# EAGLE schematic usb tester (EAGLE 7.6.0)
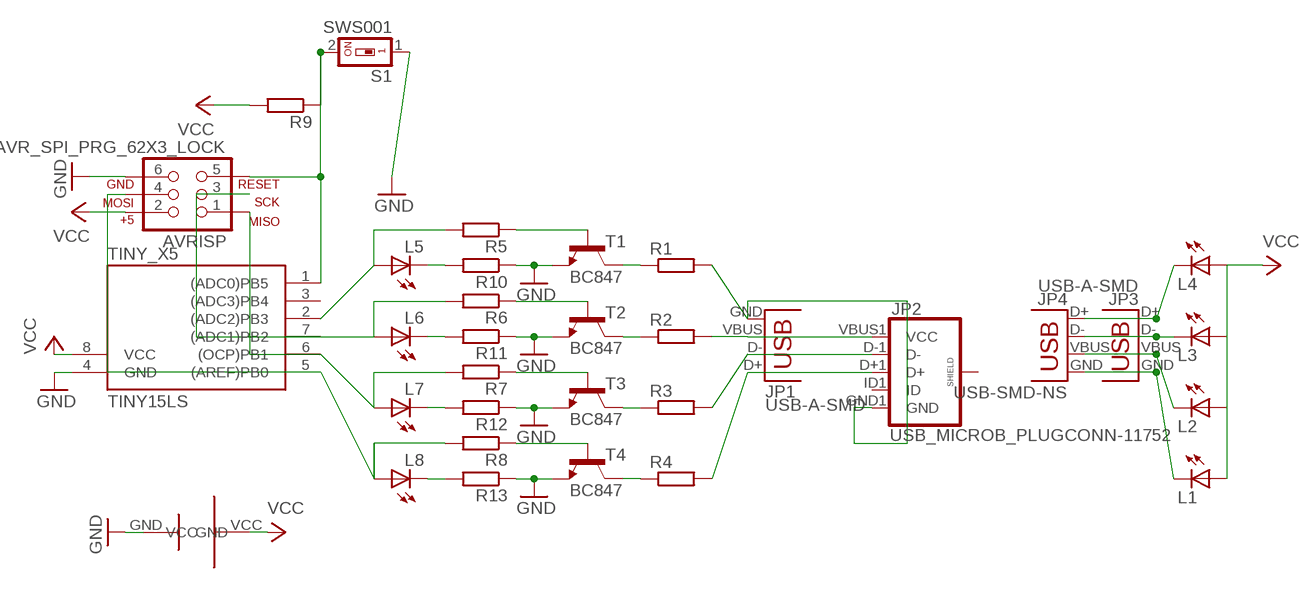
[diagram p0: schematic, sheet 1]

## Parts
AVRISP  AVR_SPI_PRG_62X3_LOCK  [2X3_LOCK]
JP1  USB-A-SMD  [USB-A-S-NOSILK-FEMALE]
JP2  USB_MICROB_PLUGCONN-11752  [USB-B-MICRO-SMD_V03]
JP3  USB-A-SMD  [USB-A-S-NOSILK-FEMALE]
JP4  USB-SMD-NS  [USB-MINIB-NOSTOP]
L1  LEDSMT1206  [1206]
L2  LEDSMT1206  [1206]
L3  LEDSMT1206  [1206]
L4  LEDSMT1206  [1206]
L5  LEDSMT1206  [1206]
L6  LEDSMT1206  [1206]
L7  LEDSMT1206  [1206]
L8  LEDSMT1206  [1206]
R1  R-EU_R1206  [R1206]
R2  R-EU_R1206  [R1206]
R3  R-EU_R1206  [R1206]
R4  R-EU_R1206  [R1206]
R5  R-EU_R1206  [R1206]
R6  R-EU_R1206  [R1206]
R7  R-EU_R1206  [R1206]
R8  R-EU_R1206  [R1206]
R9  R-EU_R1206  [R1206]
R10  R-EU_R1206  [R1206]
R11  R-EU_R1206  [R1206]
R12  R-EU_R1206  [R1206]
R13  R-EU_R1206  [R1206]
S1  SWS001  [SMS-001]
T1  BC847  [SOT23]
T2  BC847  [SOT23]
T3  BC847  [SOT23]
T4  BC847  [SOT23]
TINY_X5  TINY15LS  [SOIC8]
U$1  BATTERY  [BATTERY]

## Nets
GND: AVRISP.6 R10.1 R11.1 R12.1 R13.1 S1.1 T1.2(E) T2.2(E) T3.2(E) T4.2(E) TINY_X5.4(GND) U$1.GND
N$1: R1.1 T1.3(C)
N$2: R2.1 T2.3(C)
N$3: R3.1 T3.3(C)
N$4: R4.1 T4.3(C)
N$5: R5.1 T1.1(B)
N$7: R7.1 T3.1(B)
N$8: AVRISP.1 L7.A R7.2 TINY_X5.6((OCP)PB1)
N$9: R8.1 T4.1(B)
N$10: JP1.GND JP2.GND1(GND) R1.2
N$11: JP1.VBUS JP2.VBUS1(VCC) R2.2
N$12: JP1.D- JP2.D-1(D-) R3.2
N$13: JP1.D+ JP2.D+1(D+) R4.2
N$14: AVRISP.4 L8.A R8.2 TINY_X5.5((AREF)PB0)
N$16: L5.A R5.2 TINY_X5.2((ADC2)PB3)
N$19: JP3.GND JP4.GND L1.C
N$20: JP3.VBUS JP4.VBUS L2.C
N$21: JP3.D- JP4.D- L3.C
N$22: JP3.D+ JP4.D+ L4.C
N$25: L8.C R13.2
N$26: AVRISP.5 R9.1 S1.2 TINY_X5.1((ADC0)PB5)
N$27: AVRISP.3 L6.A R6.2 TINY_X5.7((ADC1)PB2)
N$30: L5.C R10.2
N$31: L6.C R11.2
N$32: L7.C R12.2
N$33: R6.1 T2.1(B)
VCC: AVRISP.2 L1.A L2.A L3.A L4.A R9.2 TINY_X5.8(VCC) U$1.VCC
Unconnected: JP2.ID1(ID) JP2.SHIELD1(SHIELD) JP2.SHIELD2(SHIELD) JP2.SHIELD3(SHIELD) TINY_X5.3((ADC3)PB4)

## Library data of the parts
AVRISP = SparkFun-Connectors:AVR_SPI_PRG_6: AVR ISP 6 Pin This is the reduced ISP connector for AVR programming. Common on Arduino. This footprint will take up less PCB space and can be used with a 10-pin to 6-pin adapter such as SKU: BOB-08508 **Special note about "TEST_POINT" package. The stop mask is on the top side, so if you want your programming test points to be on the bottom of your board, make sure to place this package on the bottom side of the board. This also ensure that the orientation to program from the bottom side will be correct.
JP1 JP3 = SparkFun-Connectors:USB: USB Connectors USB-B-PTH is fully proven SKU : PRT-00139/CONN-08278 USB-miniB is fully proven SKU : PRT-00587 USB-A-PCB is untested. USB-A-H is throughly reviewed, but untested. Spark Fun Electronics SKU : PRT-00437 USB-B-SMT is throughly reviewed, but untested. Needs silkscreen touching up. USB-A-S has not been used/tested USB-MB-H has not been used/tested USB-MICROB has been used. CONN-09505; PROD_ID: CONN-09520
JP2 = SparkFun-Connectors:USB_MICROB_PLUG: USB Micro-B connectors Some male, some female. Watch your step!; PROD_ID: CONN-11752
JP4 = SparkFun-Connectors:USB: USB Connectors USB-B-PTH is fully proven SKU : PRT-00139/CONN-08278 USB-miniB is fully proven SKU : PRT-00587 USB-A-PCB is untested. USB-A-H is throughly reviewed, but untested. Spark Fun Electronics SKU : PRT-00437 USB-B-SMT is throughly reviewed, but untested. Needs silkscreen touching up. USB-A-S has not been used/tested USB-MB-H has not been used/tested USB-MICROB has been used. CONN-09505
L1-L8 = led:LED: LED OSRAM: - CHIPLED LG R971, LG N971, LY N971, LG Q971, LY Q971, LO R971, LY R971 LH N974, LH R974 LS Q976, LO Q976, LY Q976 LO Q996 - Hyper CHIPLED LW Q18S LB Q993, LB Q99A, LB R99A - SideLED LS A670, LO A670, LY A670, LG A670, LP A670 LB A673, LV A673, LT A673, LW A673 LH A674 LY A675 LS A676, LA A676, LO A676, LY A676, LW A676 LS A679, LY A679, LG A679 - Hyper Micro SIDELED® LS Y876, LA Y876, LO Y876, LY Y876 LT Y87S - SmartLED LW L88C, LW L88S LB L89C, LB L89S, LG L890 LS L89K, LO L89K, LY L89K LS L896, LA L896, LO L896, LY L896 - TOPLED LS T670, LO T670, LY T670, LG T670, LP T670 LSG T670, LSP T670, LSY T670, LOP T670, LYG T670 LG T671, LOG T671, LSG T671 LB T673, LV T673, LT T673, LW T673 LH T674 LS T676, LA T676, LO T676, LY T676, LB T676, LH T676, LSB T676, LW T676 LB T67C, LV T67C, LT T67C, LS T67K, LO T67K, LY T67K, LW E67C LS E67B, LA E67B, LO E67B, LY E67B, LB E67C, LV E67C, LT E67C LW T67C LS T679, LY T679, LG T679 LS T770, LO T770, LY T770, LG T770, LP T770 LB T773, LV T773, LT T773, LW T773 LH T774 LS E675, LA E675, LY E675, LS T675 LS T776, LA T776, LO T776, LY T776, LB T776 LHGB T686 LT T68C, LB T68C - Hyper Mini TOPLED® LB M676 - Mini TOPLED Santana® LG M470 LS M47K, LO M47K, LY M47K Source: http://www.osram.convergy.de LUXEON: - LUMILED® LXK2-PW12-R00, LXK2-PW12-S00, LXK2-PW14-U00, LXK2-PW14-V00 LXK2-PM12-R00, LXK2-PM12-S00, LXK2-PM14-U00 LXK2-PE12-Q00, LXK2-PE12-R00, LXK2-PE12-S00, LXK2-PE14-T00, LXK2-PE14-U00 LXK2-PB12-K00, LXK2-PB12-L00, LXK2-PB12-M00, LXK2-PB14-N00, LXK2-PB14-P00, LXK2-PB14-Q00 LXK2-PR12-L00, LXK2-PR12-M00, LXK2-PR14-Q00, LXK2-PR14-R00 LXK2-PD12-Q00, LXK2-PD12-R00, LXK2-PD12-S00 LXK2-PH12-R00, LXK2-PH12-S00 LXK2-PL12-P00, LXK2-PL12-Q00, LXK2-PL12-R00 Source: www.luxeon.com KINGBRIGHT: KA-3528ASYC Source: www.kingbright.com
R1-R13 = rcl:R-EU_: RESISTOR, European symbol
S1 = smd-special:SWS001: SMD Dip Switch 1 pol.
T1-T4 = transistor:BC847: NPN TRANSISTOR
TINY_X5 = atmel:TINY15L: MICROCONTROLLER 2.7 V 1 Kbytes FLASH 64 bytes EEPROM 4-channel 10 bit ADC; OC_FARNELL: unknown; OC_NEWARK: unknown
U$1 = USB_tester:BATTERY